# Altium schematic sheet BuckRegulator-3V.SchDoc
size A4; SheetNumber: 5; SheetTotal: 8
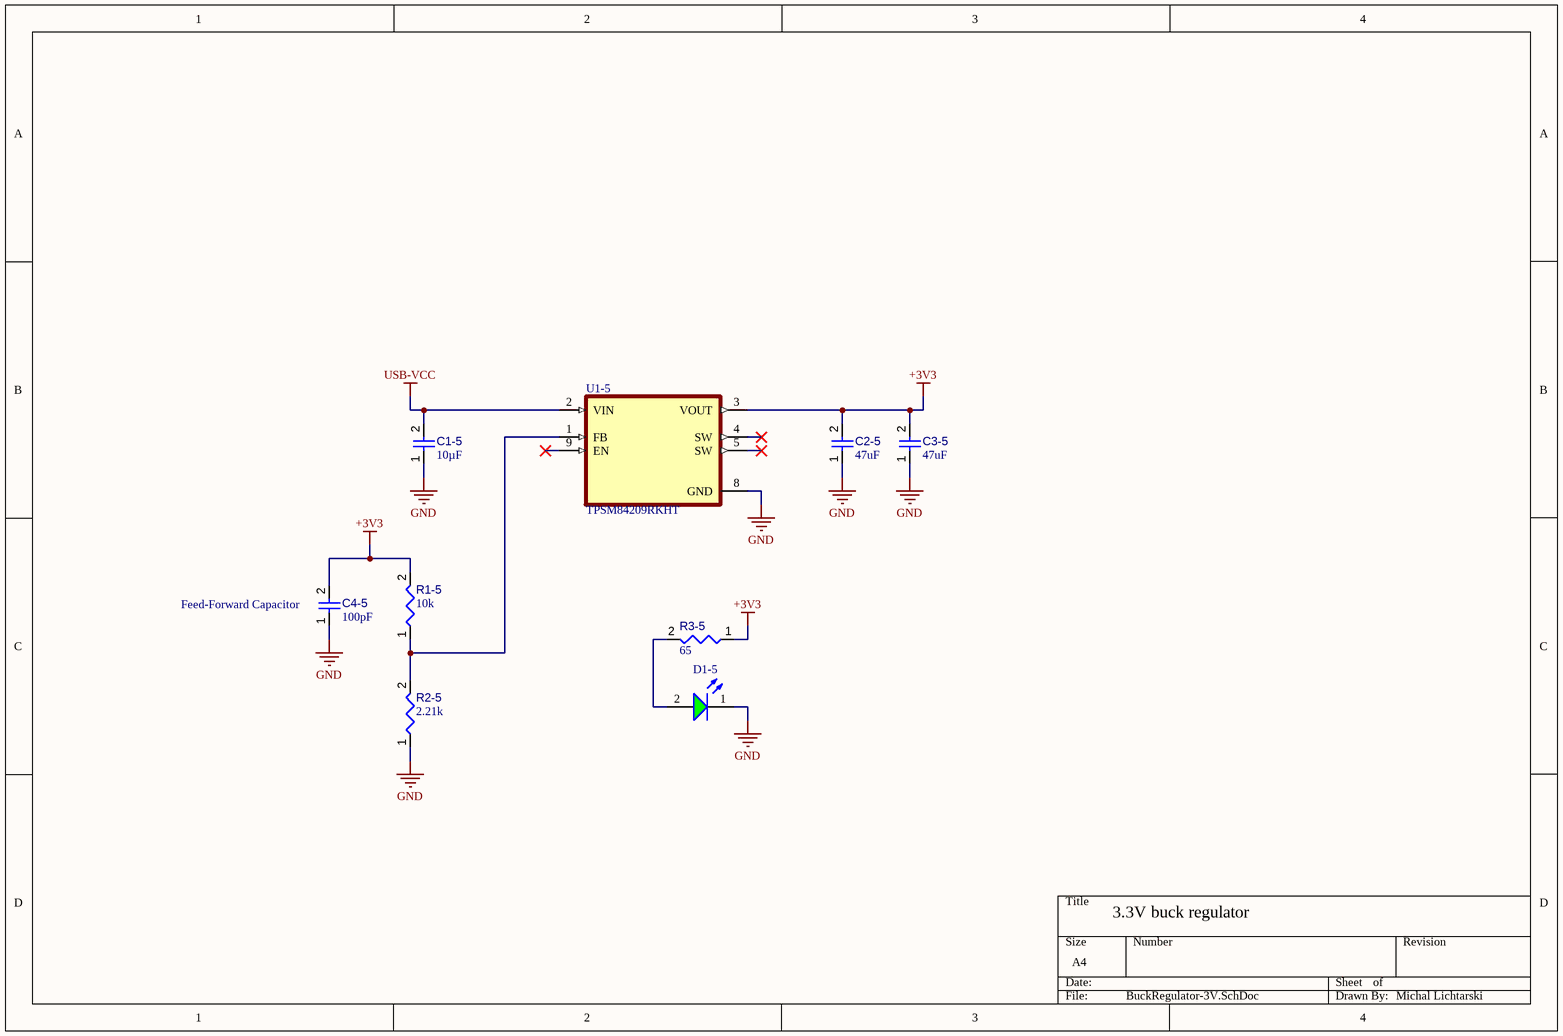
[diagram p0: BuckRegulator-3V.SchDoc]

## Parts
C1-5  value 10µF  [CAPC3216X180X50NL20T25]  (hidden comment: 10uF 0603)
C2-5  value 47uF  [CAPC1608X94X35NL15T15]  (hidden comment: 47uF 0603)
C3-5  value 47uF  [CAPC1608X94X35NL15T15]  (hidden comment: 47uF 0603)
C4-5  value 100pF  [CAPC1608X94X35NL15T15]  (hidden comment: 100pF 0603)
D1-5  150060VS75000  [WL-SMCW_0603_150060xx75000]  (value not drawn)
R1-5  10k  [RESC1608X55X25ML10T15]
R2-5  2.21k  [RESC1608X55X25ML10T15]
R3-5  65  [RESC1608X55X25ML10T15]
U1-5  TPSM84209RKHT  [VREG_TPSM84209RKHT]

## Nets
+3V3: C2-5.2 C3-5.2 C4-5.2 R1-5.2 R3-5.1 U1-5.3(VOUT)
GND: C1-5.1 C2-5.1 C3-5.1 C4-5.1 D1-5.1(K) R2-5.1 U1-5.8(GND)
USB-VCC: C1-5.2 U1-5.2(VIN)
NetD1-5_2: D1-5.2(A) R3-5.2
NetR1-5_1: R1-5.1 R2-5.2 U1-5.1(FB)

Not connected (* = marked no-connect by the designer): U1-5 4(SW)* 5(SW)* 9(EN)*

## Notes on the sheet
- (near C4-5) Feed-Forward Capacitor
- 3.3V buck regulator
- Michal Lichtarski

## Library data of the parts
C1-5 = CMP-001-00016-6: Tolerance: 10%; Capacitor Type: Ceramic; Voltage Rating: 16V; Min Operating Temperature: -55°C; Pins: 2; Mounting Technology: SM; Case/Package: 1206; Max Operating Temperature: 125°C; RoHS Compliant: True
C2-5 C3-5 C4-5 = CMP-001-00003-6: Tolerance: 10%; Voltage Rating: 16V; Capacitor Type: Ceramic; Max Operating Temperature: 125°C; Pins: 2; Min Operating Temperature: -55°C; RoHS Compliant: True; Mounting Technology: SM; Case/Package: 0603
D1-5 = CMP-1426-00006-6: NexarPartId: 29717778; Reverse Voltage: 5V; Forward Voltage: 2V; Viewing Angle: 140°; Luminous Intensity: 40mcd; Test Current: 20mA; Max Junction Temperature (Tj): 95°C; Wavelength: 570nm; Forward Current: 100mA; Color: Green; Lens Style: Clear, Rectangular; Power Dissipation: 72mW; Peak Wavelength: 572nm; Packaging: Tape and Reel; REACH SVHC: Unknown; Width: 800µm; Max Operating Temperature: 85°C; Number of Pins: 2; RoHS: Compliant; Dominant Wavelength: 570nm; Min Operating Temperature: -40°C; Case Code (Imperial): 0603; Height: 700µm; Length: 1.6mm; Case Code (Metric): 1608; Case/Package: 0603; Max Reverse Voltage (DC): 5V; Mount: Surface Mount
R1-5 R2-5 R3-5 = CMP-009-00031-5: Tolerance: 1%; Power: 100mW; Mounting Technology: SM; Case/Package: 0603; RoHS Compliant: True; Pins: 2; Min Operating Temperature: -55°C; Max Operating Temperature: 155°C
  R1-5: Value: 10k
  R2-5: Value: 2.21k
  R3-5: Value: 65
U1-5 = TPSM84209RKHT: MF: {'manufacturer': u'Texas Instruments'}; Package: None; Price: None; Value: *; MP: TPSM84209RKHT; Availability: Unavailable